# EAGLE design PIC12F629 (EAGLE 7.7.0)
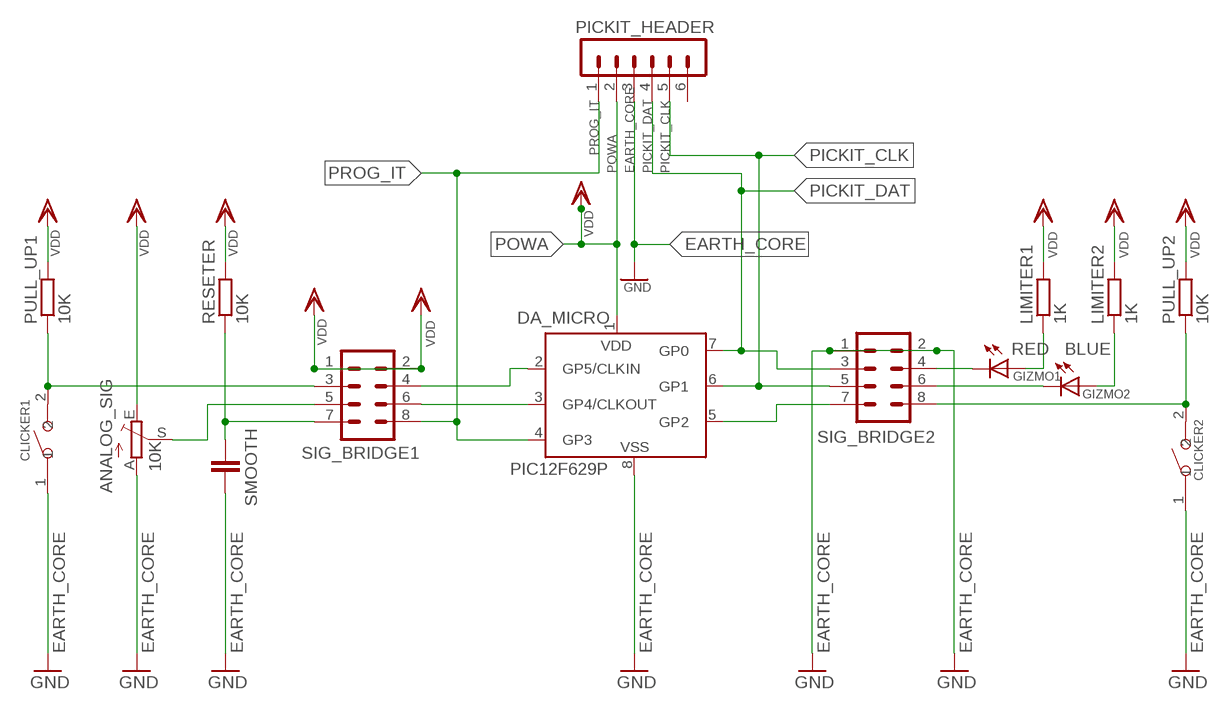
[diagram p0: schematic, sheet 1]

## Parts
ANALOG_SIG  10K  TRIM_EU-CA6V  [CA6V]
CLICKER1  SMD-BUTTON(2P-6.0X3.0X2.5MM)-DHT-1163S  [SW2-4.0-6.0X3.0X2.5MM]
CLICKER2  SMD-BUTTON(2P-6.0X3.0X2.5MM)-DHT-1163S  [SW2-4.0-6.0X3.0X2.5MM]
DA_MICRO  PIC12F629P  [DIL8]
GIZMO1  RED  LEDCHIP-LED0805  [CHIP-LED0805]
GIZMO2  BLUE  LEDCHIP-LED0805  [CHIP-LED0805]
LIMITER1  1K  R-EU_R0805  [R0805]
LIMITER2  1K  R-EU_R0805  [R0805]
PICKIT_HEADER  MA06-1  [MA06-1]
PULL_UP1  10K  R-EU_R0805  [R0805]
PULL_UP2  10K  R-EU_R0805  [R0805]
RESETER  10K  R-EU_R0805  [R0805]
SIG_BRIDGE1  MA04-2  [MA04-2]
SIG_BRIDGE2  MA04-2  [MA04-2]
SMOOTH  C-EUC0805K  [C0805K]

## Nets
EARTH_CORE: ANALOG_SIG.A CLICKER1.1 CLICKER2.1 DA_MICRO.8(VSS) PICKIT_HEADER.3 SIG_BRIDGE2.1 SIG_BRIDGE2.2 SMOOTH.2 ; supply symbol labelled GND
N$1: DA_MICRO.3(GP4/CLKOUT) SIG_BRIDGE1.6
N$2: DA_MICRO.5(GP2) SIG_BRIDGE2.7
N$3: DA_MICRO.2(GP5/CLKIN) SIG_BRIDGE1.4
N$4: GIZMO1.C SIG_BRIDGE2.4
N$5: GIZMO2.C SIG_BRIDGE2.6
N$6: GIZMO1.A LIMITER1.1
N$7: GIZMO2.A LIMITER2.1
N$8: CLICKER2.2 PULL_UP2.1 SIG_BRIDGE2.8
N$9: CLICKER1.2 PULL_UP1.1 SIG_BRIDGE1.3
N$10: ANALOG_SIG.S SIG_BRIDGE1.5
N$11: RESETER.1 SIG_BRIDGE1.7 SMOOTH.1
PICKIT_CLK: DA_MICRO.6(GP1) PICKIT_HEADER.5 SIG_BRIDGE2.5
PICKIT_DAT: DA_MICRO.7(GP0) PICKIT_HEADER.4 SIG_BRIDGE2.3
POWA: ANALOG_SIG.E DA_MICRO.1(VDD) LIMITER1.2 LIMITER2.2 PICKIT_HEADER.2 PULL_UP1.2 PULL_UP2.2 RESETER.2 SIG_BRIDGE1.1 SIG_BRIDGE1.2 ; supply symbol labelled VDD
PROG_IT: DA_MICRO.4(GP3) PICKIT_HEADER.1 SIG_BRIDGE1.8
Unconnected: PICKIT_HEADER.6

## Library data of the parts
ANALOG_SIG = pot:TRIM_EU-: POTENTIOMETER
CLICKER1 CLICKER2 = Seeed-OPL-Switch:SMD-BUTTON(2P-6.0X3.0X2.5MM): 311020029
DA_MICRO = microchip:PIC12F6*: Data Sheet 8-Pin FLASH-Based 8-Bit CMOS Microcontrollers Source: http://www.microchip.com .. 41190c.pdf; MF: MICROCHIP; MPN: PIC12F629-I/P; OC_FARNELL: 1292253; OC_NEWARK: 67K0822
GIZMO1 GIZMO2 = led:LED: LED OSRAM: - CHIPLED LG R971, LG N971, LY N971, LG Q971, LY Q971, LO R971, LY R971 LH N974, LH R974 LS Q976, LO Q976, LY Q976 LO Q996 - Hyper CHIPLED LW Q18S LB Q993, LB Q99A, LB R99A - SideLED LS A670, LO A670, LY A670, LG A670, LP A670 LB A673, LV A673, LT A673, LW A673 LH A674 LY A675 LS A676, LA A676, LO A676, LY A676, LW A676 LS A679, LY A679, LG A679 - Hyper Micro SIDELED® LS Y876, LA Y876, LO Y876, LY Y876 LT Y87S - SmartLED LW L88C, LW L88S LB L89C, LB L89S, LG L890 LS L89K, LO L89K, LY L89K LS L896, LA L896, LO L896, LY L896 - TOPLED LS T670, LO T670, LY T670, LG T670, LP T670 LSG T670, LSP T670, LSY T670, LOP T670, LYG T670 LG T671, LOG T671, LSG T671 LB T673, LV T673, LT T673, LW T673 LH T674 LS T676, LA T676, LO T676, LY T676, LB T676, LH T676, LSB T676, LW T676 LB T67C, LV T67C, LT T67C, LS T67K, LO T67K, LY T67K, LW E67C LS E67B, LA E67B, LO E67B, LY E67B, LB E67C, LV E67C, LT E67C LW T67C LS T679, LY T679, LG T679 LS T770, LO T770, LY T770, LG T770, LP T770 LB T773, LV T773, LT T773, LW T773 LH T774 LS E675, LA E675, LY E675, LS T675 LS T776, LA T776, LO T776, LY T776, LB T776 LHGB T686 LT T68C, LB T68C - Hyper Mini TOPLED® LB M676 - Mini TOPLED Santana® LG M470 LS M47K, LO M47K, LY M47K Source: http://www.osram.convergy.de LUXEON: - LUMILED® LXK2-PW12-R00, LXK2-PW12-S00, LXK2-PW14-U00, LXK2-PW14-V00 LXK2-PM12-R00, LXK2-PM12-S00, LXK2-PM14-U00 LXK2-PE12-Q00, LXK2-PE12-R00, LXK2-PE12-S00, LXK2-PE14-T00, LXK2-PE14-U00 LXK2-PB12-K00, LXK2-PB12-L00, LXK2-PB12-M00, LXK2-PB14-N00, LXK2-PB14-P00, LXK2-PB14-Q00 LXK2-PR12-L00, LXK2-PR12-M00, LXK2-PR14-Q00, LXK2-PR14-R00 LXK2-PD12-Q00, LXK2-PD12-R00, LXK2-PD12-S00 LXK2-PH12-R00, LXK2-PH12-S00 LXK2-PL12-P00, LXK2-PL12-Q00, LXK2-PL12-R00 Source: www.luxeon.com KINGBRIGHT: KA-3528ASYC Source: www.kingbright.com
LIMITER1 LIMITER2 PULL_UP1 PULL_UP2 RESETER = rcl:R-EU_: RESISTOR, European symbol
PICKIT_HEADER = con-lstb:MA06-1: PIN HEADER; OC_FARNELL: unknown; OC_NEWARK: unknown
SIG_BRIDGE1 SIG_BRIDGE2 = con-lstb:MA04-2: PIN HEADER; OC_FARNELL: unknown; OC_NEWARK: unknown
SMOOTH = resistor:C-EU: CAPACITOR, European symbol

## Net classes
0 default: width 0.152 mm, clearance 0.152 mm

## Board
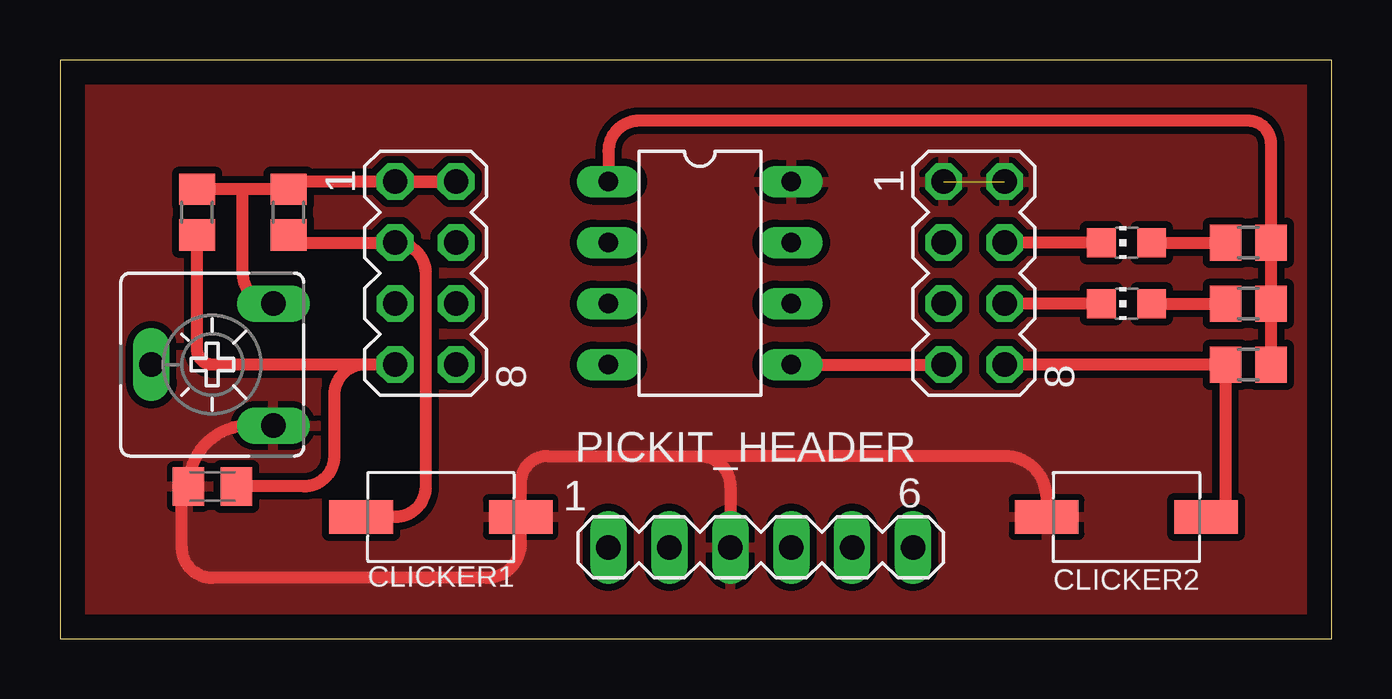
[diagram p1: board, top side]
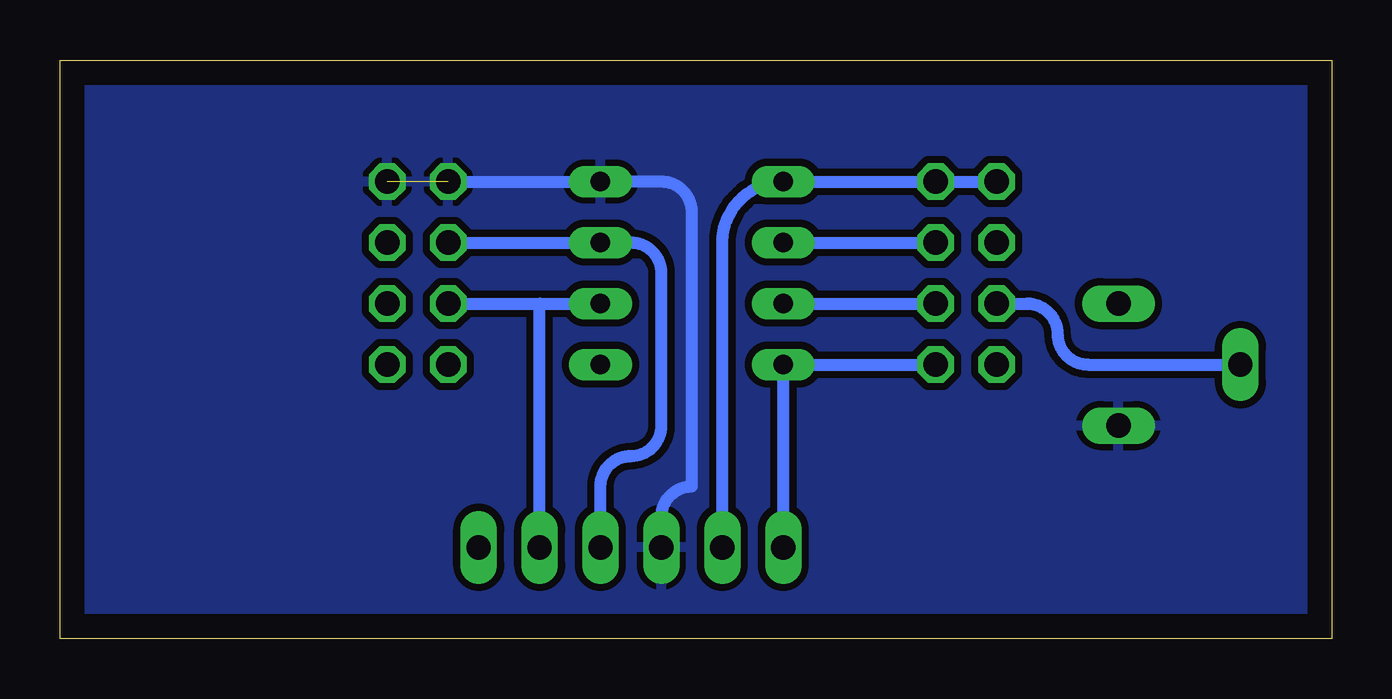
[diagram p2: board, bottom side, seen from below]

Size 53.01 x 24.12 mm. Coordinates in mm from the lower left corner, seen from the top.
Outline: 0,0 53.01,0 53.01,24.12 0,24.12 0,0
Copper layers (1*16): Top 0.035mm / dielectric 1.5mm / Bottom 0.035mm
Design rules "default *": minimum track width 10mil, minimum drill 24mil, track to track 0.3mm, track to pad 0.3mm, pad to pad 0.3mm, via to via 0.3mm, smd to smd 0.3mm, copper to edge 40mil, drill to drill 8mil, minimum pad ring 10mil, minimum via ring 8mil, stop-mask expansion 4mil, vias tented up to drill 0mil, thermal gap 10mil

### Footprints (pad centres in the part's own frame; a part is rotated, then mirrored left to right if it is on the bottom)
CA6V = drill 1.016 long: A -2.54,-2.54; E 2.54,-2.54; S 0,2.54
SW2-4.0-6.0X3.0X2.5MM = smd 2.65 x 1.4: 1 -3.325,0; 2 3.325,0
DIL8 = drill 0.813 long: 1 -3.81,-3.81; 2 -1.27,-3.81; 3 1.27,-3.81; 4 3.81,-3.81; 5 3.81,3.81; 6 1.27,3.81; 7 -1.27,3.81; 8 -3.81,3.81
CHIP-LED0805 = smd 1.2 x 1.2: A 0,-1.05; C 0,1.05
R0805 = smd 1.3 x 1.5: 1 -0.95,0; 2 0.95,0
MA06-1 = drill 1.016 long: 1 -6.35,0; 2 -3.81,0; 3 -1.27,0; 4 1.27,0; 5 3.81,0; 6 6.35,0
MA04-2 = drill 1.016 octagon: 1 -3.81,-1.27; 2 -3.81,1.27; 3 -1.27,-1.27; 4 -1.27,1.27; 5 1.27,-1.27; 6 1.27,1.27; 7 3.81,-1.27; 8 3.81,1.27
C0805K = smd 1.3 x 1.6: 1 -1,0; 2 1,0

### Placement (x,y rotation side)
ANALOG_SIG  6.35,11.43 90 top
CLICKER1  15.88,5.08 180 top
CLICKER2  44.45,5.08 0 top
DA_MICRO  26.67,15.24 270 top
GIZMO1  44.45,16.51 90 top
GIZMO2  44.45,13.97 90 top
LIMITER1  49.53,16.51 0 top
LIMITER2  49.53,13.97 0 top
PICKIT_HEADER  29.21,3.81 0 top
PULL_UP1  9.53,17.78 90 top
PULL_UP2  49.53,11.43 0 top
RESETER  5.71,17.78 90 top
SIG_BRIDGE1  15.24,15.24 270 top
SIG_BRIDGE2  38.1,15.24 270 top
SMOOTH  6.35,6.35 180 top

### Tracks (layer width: path | path; a pad name or v marks a point on that pad's centre or on a via)
EARTH_CORE  (1 unrouted)
  Top 0.5: ANALOG_SIG.A 7.89,8.89 arc90 SMOOTH.2 arc90 5.08,6.08 5.08,3.81 arc90 6.35,2.54 17.78,2.54 arc90 19.2,3.96 CLICKER1.1 19.2,6.5 arc-90 20.32,7.62 26.67,7.62 | CLICKER2.1 41.12,5.87 arc90 39.37,7.62 26.67,7.62 | 26.67,7.62 arc-90 27.94,6.35 PICKIT_HEADER.3
  Bottom 0.5: SIG_BRIDGE2.1 DA_MICRO.8 27.94,19.05 arc90 26.67,17.78 26.67,6.35 arc-90 27.94,5.08 PICKIT_HEADER.3
  pour Top: -1.27,25.4 -1.27,-1.27 54.61,-1.27 54.61,25.4
  pour Bottom: -1.27,25.4 -1.27,-1.27 54.61,-1.27 54.61,25.4
N$1
  Bottom 0.5: DA_MICRO.3 SIG_BRIDGE1.6
N$2
  Top 0.5: DA_MICRO.5 SIG_BRIDGE2.7
N$3
  Bottom 0.5: DA_MICRO.2 SIG_BRIDGE1.4
N$4
  Top 0.5: GIZMO1.C SIG_BRIDGE2.4
N$5
  Top 0.5: GIZMO2.C SIG_BRIDGE2.6
N$6
  Top 0.5: GIZMO1.A LIMITER1.1
N$7
  Top 0.5: GIZMO2.A LIMITER2.1
N$8
  Top 0.5: SIG_BRIDGE2.8 PULL_UP2.1 48.58,5.4 arc-90 48.26,5.08 CLICKER2.2
N$9
  Top 0.5: PULL_UP1.1 arc90 9.85,16.51 SIG_BRIDGE1.3 arc-90 15.24,15.24 15.24,6.35 arc-90 13.97,5.08 CLICKER1.2
N$10
  Bottom 0.5: SIG_BRIDGE1.5 12.7,13.97 arc90 11.43,12.7 arc-90 10.16,11.43 ANALOG_SIG.S
N$11
  Top 0.5: SMOOTH.1 10.16,6.35 arc90 11.43,7.62 11.43,10.16 arc-90 12.7,11.43 SIG_BRIDGE1.7 6.35,11.43 arc-90 5.71,12.06 RESETER.1
PICKIT_CLK
  Bottom 0.5: SIG_BRIDGE2.5 33.02,13.97 | 33.02,13.97 DA_MICRO.6 | PICKIT_HEADER.5 33.02,13.97
PICKIT_DAT
  Bottom 0.5: SIG_BRIDGE2.3 DA_MICRO.7 29.21,16.51 arc90 27.94,15.24 27.94,8.89 arc90 29.21,7.62 arc-90 30.48,6.35 PICKIT_HEADER.4
POWA
  Top 0.5: PULL_UP2.2 LIMITER2.2 50.8,13.97 arc-90 50.48,14.29 LIMITER1.2 50.48,20.64 arc90 49.53,21.59 24.13,21.59 arc90 22.86,20.32 DA_MICRO.1 | SIG_BRIDGE1.1 SIG_BRIDGE1.2 9.85,19.05 arc90 PULL_UP1.2 7.62,18.73 | 7.62,18.73 RESETER.2 | ANALOG_SIG.E arc-90 7.62,15.24 7.62,18.73
  Bottom 0.5: PICKIT_HEADER.2 25.4,16.51 arc90 DA_MICRO.1 SIG_BRIDGE1.2 SIG_BRIDGE1.1
PROG_IT
  Bottom 0.5: SIG_BRIDGE1.8 DA_MICRO.4 PICKIT_HEADER.1